# Altium project mopedka ver.PrjPcb
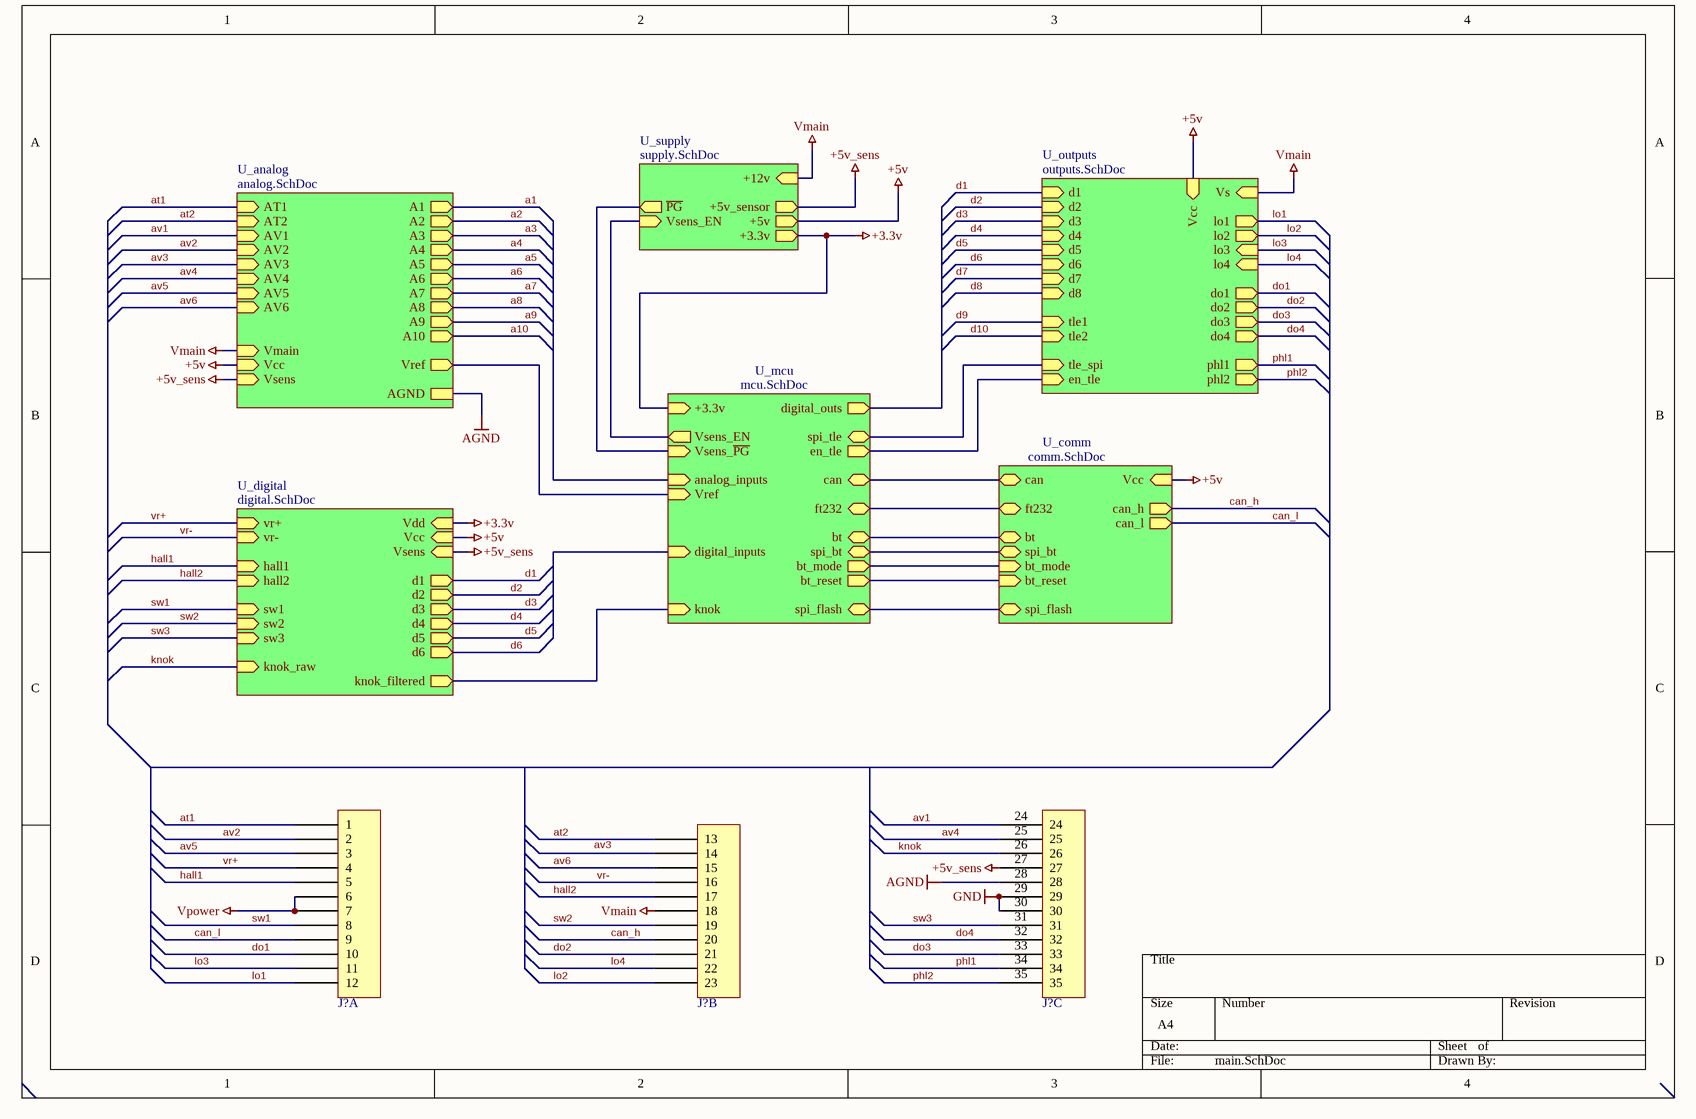
[diagram p0: main.SchDoc]
7 sheets, 327 parts. Net scope: hierarchical (ports join the sheet entries above them; power ports are global).
Board file: PCB1.PcbDoc
Sheets:
  main.SchDoc
    U_analog = analog.SchDoc
    U_digital = digital.SchDoc
    U_outputs = outputs.SchDoc
    U_comm = comm.SchDoc
    U_supply = supply.SchDoc
    U_mcu = mcu.SchDoc

## Sheet main.SchDoc
size A4

### Parts
(Parts that share a designator on the sheet are numbered #1, #2 ... from top to bottom, then left to right.)
J?#1  Conn_TE_1-776163-1_eec  [TE_1-776163-1_0]  (value not drawn)  (part A of 3)
J?#2  Conn_TE_1-776163-1_eec  [TE_1-776163-1_0]  (value not drawn)  (part B of 3)
J?#3  Conn_TE_1-776163-1_eec  [TE_1-776163-1_0]  (value not drawn)  (part C of 3)

### Sub-sheets
U_analog = analog.SchDoc: AT1 (in), AT2 (in), AV1 (in), AV2 (in), AV3 (in), AV4 (in), AV5 (in), AV6 (in), A1 (out), A2 (out), A3 (out), A4 (out), A5 (out), A6 (out), A7 (out), A8 (out), A9 (out), A10 (out), Vmain (in), Vcc (in), Vsens (in), AGND, Vref (out)
U_comm = comm.SchDoc: can (bidir), bt (bidir), ft232 (bidir), spi_flash (bidir), spi_bt (bidir), can_h (out), can_l (out), Vcc (in), bt_mode (in), bt_reset (in)
U_digital = digital.SchDoc: hall1 (in), hall2 (in), sw1 (in), sw2 (in), knok_raw (in), vr+ (in), vr- (in), d1 (out), d2 (out), d3 (out), d4 (out), knok_filtered (out), d6 (out), sw3 (in), d5 (out), Vdd (in), Vcc (in), Vsens (in)
U_mcu = mcu.SchDoc: analog_inputs (in), digital_outs (out), +3.3v (in), Vsens_EN (out), Vsens_~{PG} (in), digital_inputs (in), knok (in), can (bidir), bt (bidir), ft232 (bidir), spi_tle (bidir), spi_flash (bidir), spi_bt (bidir), en_tle (out), bt_mode (out), bt_reset (out), Vref (in)
U_outputs = outputs.SchDoc: lo1 (out), lo2 (out), do1 (out), do2 (out), do3 (out), do4 (out), phl1 (out), phl2 (out), tle1 (in), tle2 (in), tle_spi (in), Vs (in), d1 (in), d2 (in), d3 (in), d4 (in), d5 (in), d6 (in), d7 (in), d8 (in), lo3 (in), lo4 (in), en_tle (in), Vcc (in)
U_supply = supply.SchDoc: +12v (in), +5v (out), +5v_sensor (out), +3.3v (out), ~{PG} (out), Vsens_EN (in)

### Nets
+3.3v: sheet U_analog/Vcc, sheet U_digital/Vdd, sheet U_digital/Vcc, sheet U_outputs/Vcc, sheet U_comm/Vcc, sheet U_supply/+5v, sheet U_supply/+3.3v, sheet U_mcu/+3.3v  [also labelled +5v]
+5v_sens: J?#3.27 ; sheet U_analog/Vsens, sheet U_digital/Vsens, sheet U_supply/+5v_sensor
AGND: J?#3.28 ; sheet U_analog/AGND
GND: J?#3.29 J?#3.30
Vmain: J?#2.18 ; sheet U_analog/Vmain, sheet U_outputs/Vs, sheet U_supply/+12v
Vpower: J?#1.6 J?#1.7
at1: J?#1.1 ; sheet U_analog/AT1
at2: J?#2.13 ; sheet U_analog/AT2
av1: J?#3.24 ; sheet U_analog/AV1
av2: J?#1.2 ; sheet U_analog/AV2
av4: J?#3.25 ; sheet U_analog/AV4
av5: J?#1.3 ; sheet U_analog/AV5
av6: J?#2.15 ; sheet U_analog/AV6
can_h: J?#2.20 ; sheet U_comm/can_h
can_l: J?#1.9 ; sheet U_comm/can_l
d1: sheet U_digital/d1, sheet U_outputs/d1
d2: sheet U_digital/d2, sheet U_outputs/d2
d3: sheet U_digital/d3, sheet U_outputs/d3
d4: sheet U_digital/d4, sheet U_outputs/d4
d5: sheet U_digital/d5, sheet U_outputs/d5
d6: sheet U_digital/d6, sheet U_outputs/d6
do1: J?#1.10 ; sheet U_outputs/do1
do2: J?#2.21 ; sheet U_outputs/do2
do3: J?#3.33 ; sheet U_outputs/do3
do4: J?#3.32 ; sheet U_outputs/do4
hall1: J?#1.5 ; sheet U_digital/hall1
hall2: J?#2.17 ; sheet U_digital/hall2
knok: J?#3.26 ; sheet U_digital/knok_raw
lo1: J?#1.12 ; sheet U_outputs/lo1
lo2: J?#2.23 ; sheet U_outputs/lo2
lo3: J?#1.11 ; sheet U_outputs/lo3
lo4: J?#2.22 ; sheet U_outputs/lo4
phl1: J?#3.34 ; sheet U_outputs/phl1
phl2: J?#3.35 ; sheet U_outputs/phl2
sw1: J?#1.8 ; sheet U_digital/sw1
sw2: J?#2.19 ; sheet U_digital/sw2
sw3: J?#3.31 ; sheet U_digital/sw3
vr+: J?#1.4 ; sheet U_digital/vr+
vr-: J?#2.16 ; sheet U_digital/vr-
NetIC?#12_4: sheet U_digital/knok_filtered, sheet U_mcu/knok
NetR?#1_2: sheet U_analog/Vref, sheet U_mcu/Vref
NetR?#96_2: sheet U_outputs/en_tle, sheet U_mcu/en_tle
NetR?#98_1: sheet U_comm/bt_mode, sheet U_mcu/bt_mode
NetR?#100_1: sheet U_comm/bt_reset, sheet U_mcu/bt_reset
NetR?#126_2: sheet U_supply/~{PG}, sheet U_mcu/Vsens_~{PG}
NetR?#128_1: sheet U_supply/Vsens_EN, sheet U_mcu/Vsens_EN

Not connected (* = marked no-connect by the designer): J?#2 14

### Buses and harness runs
bus sheet U_comm/bt = sheet U_mcu/bt
bus sheet U_comm/can = sheet U_mcu/can
bus sheet U_comm/ft232 = sheet U_mcu/ft232
bus sheet U_comm/spi_bt = sheet U_mcu/spi_bt
bus sheet U_comm/spi_flash = sheet U_mcu/spi_flash
bus sheet U_mcu/spi_tle = sheet U_outputs/tle_spi

### Notes on the sheet
- Labels drawn without touching a wire or pin: av3

### Library data of the parts
J?#1-J?#3 = Conn_TE_1-776163-1_eec: CONN 35 Positions Header, Shrouded Connector 0.157" (4.00mm) Panel Mount, Through Hole, Right Angle Gold-Palladium; Manufacturer: TE; helpURL: https://upverter.com/upn/revision/16af53c132ac2fb1/; ComponentLink2Description: Datasheet; Temperature: to; Package: CONN_PTH_76MM9_18MM6; Supplier 2: Mouser; Price: 11.0652877997; Supplier 1: Digi-Key; ComponentLink1URL: https://upverter.com/upn/revision/16af53c132ac2fb1/; Supplier Part Number 2: 571-1-776163-1; Supplier Part Number 1: A106383-ND; ComponentLink1Description: Upverter; ComponentLink2URL: http://www.mouser.com/ds/2/418/NG_CD_776163_J8-683122.pdf; RoHS: TRUE; Mouser Part Number: 571-1-776163-1; Digikey Description: CONN 35 Positions Header, Shrouded Connector 0.157" (4.00mm) Panel Mount, Through Hole, Right Angle Gold-Palladium; Digikey Part Number: A106383-ND; Lead Free: yes

## Sheet analog.SchDoc
size A4
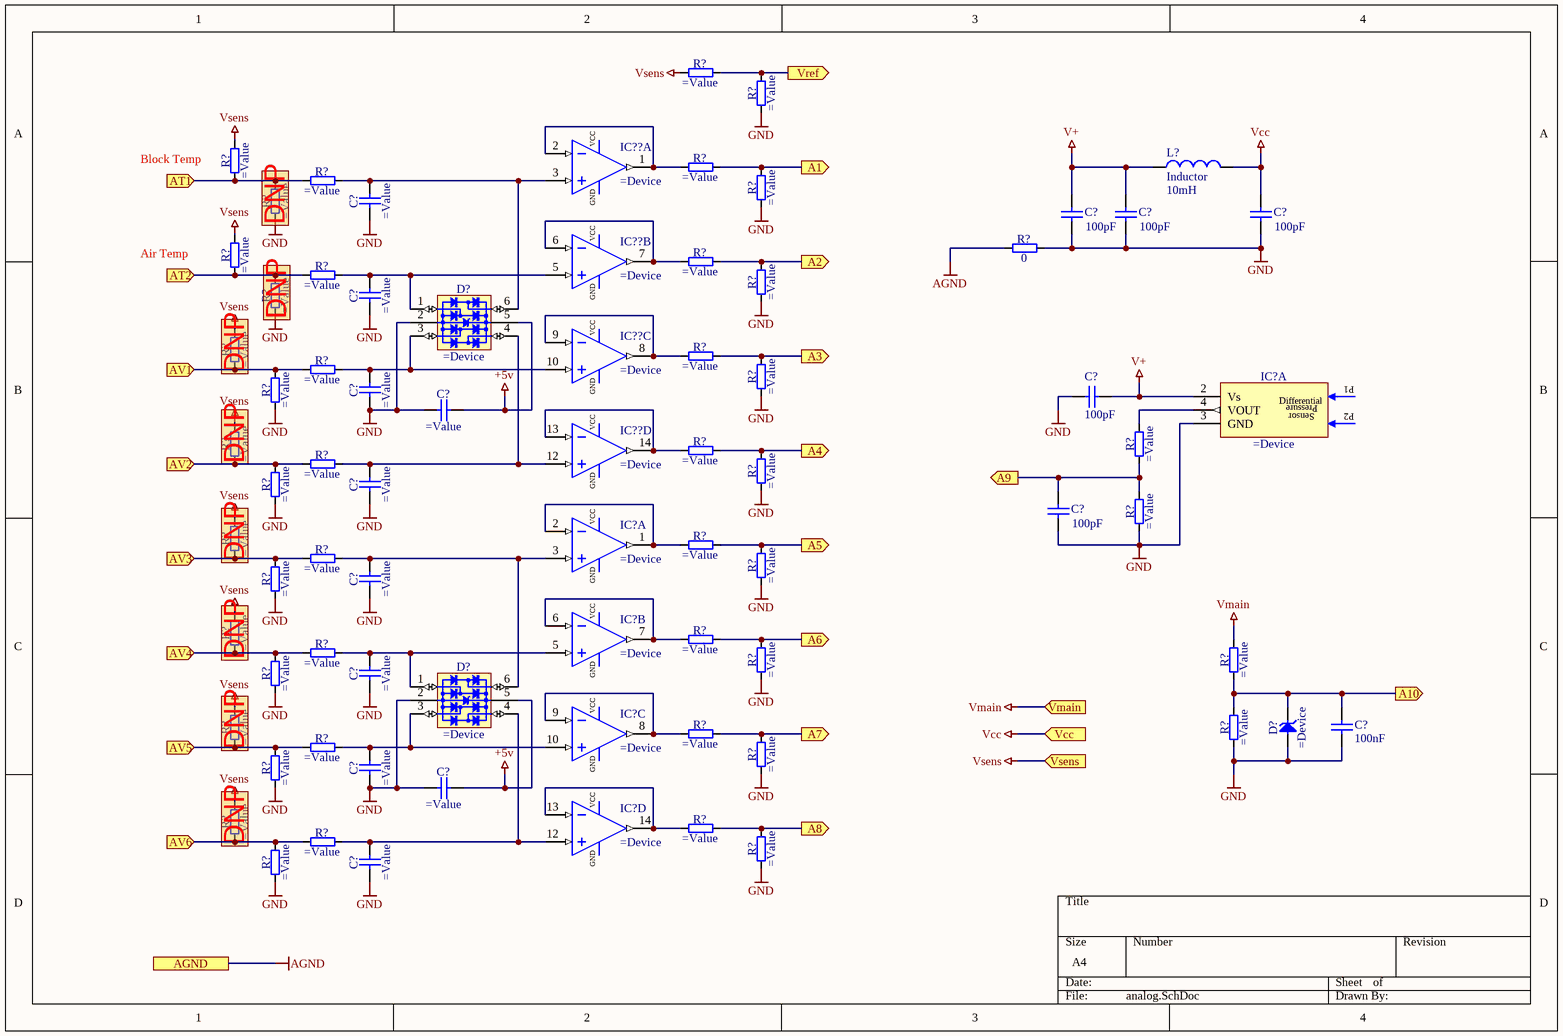
[diagram p1: analog.SchDoc]

### Parts
(Parts that share a designator on the sheet are numbered #1, #2 ... from top to bottom, then left to right.)
C?#1  (no value)
C?#2  value 100pF  [RAD-0.3]  (hidden comment: Cap)
C?#3  value 100pF  [RAD-0.3]  (hidden comment: Cap)
C?#4  value 100pF  [RAD-0.3]  (hidden comment: Cap)
C?#5  (no value)
C?#6  value 100pF  [RAD-0.3]  (hidden comment: Cap)
C?#7  (no value)
C?#8  (no value)
C?#9  (no value)
C?#10  value 100pF  [RAD-0.3]  (hidden comment: Cap)
C?#11  (no value)
C?#12  (no value)
C?#13  value 100nF  [RAD-0.3]  (hidden comment: Cap)
C?#14  (no value)
C?#15  (no value)
C?#16  (no value)
D?#1  (no value)
D?#2  (no value)
D?#3  (no value)
IC?#1  (no value)  (part A of 2)
IC?#2  (no value)  (part A of 4)
IC?#3  (no value)  (part B of 4)
IC?#4  (no value)  (part C of 4)
IC?#5  (no value)  (part D of 4)
IC??#1  (no value)  (part A of 4)
IC??#2  (no value)  (part B of 4)
IC??#3  (no value)  (part C of 4)
IC??#4  (no value)  (part D of 4)
L?#1  Inductor  value 10mH  [0402-A]
R?#1  (no value)
R?#2  (no value)
R?#3  (no value)
R?#4  (no value)
R?#5  (no value)
R?#6  (no value)
R?#7  (no value)
R?#8  0
R?#9  (no value)
R?#10  (no value)
R?#11  (no value)
R?#12  (no value)
R?#13  (no value)
R?#14  (no value)
R?#15  (no value)
R?#16  (no value)
R?#17  (no value)
R?#18  (no value)
R?#19  (no value)
R?#20  (no value)
R?#21  (no value)
R?#22  (no value)
R?#23  (no value)
R?#24  (no value)
R?#25  (no value)
R?#26  (no value)
R?#27  (no value)
R?#28  (no value)
R?#29  (no value)
R?#30  (no value)
R?#31  (no value)
R?#32  (no value)
R?#33  (no value)
R?#34  (no value)
R?#35  (no value)
R?#36  (no value)
R?#37  (no value)
R?#38  (no value)
R?#39  (no value)
R?#40  (no value)
R?#41  (no value)
R?#42  (no value)
R?#43  (no value)
R?#44  (no value)
R?#45  (no value)
R?#46  (no value)
R?#47  (no value)

### Ports
A1 (out), A2 (out), A3 (out), A4 (out), A5 (out), A6 (out), A7 (out), A8 (out), A9 (out), A10 (out), AGND, AT1 (in), AT2 (in), AV1 (in), AV2 (in), AV3 (in), AV4 (in), AV5 (in), AV6 (in), Vcc (in), Vmain (in), Vref (out), Vsens (in)

### Nets
+5v: C?#4.2 C?#8.2 C?#15.2 D?#1.5(VBUS) D?#2.5(VBUS) L?#1.2 ; port Vcc  [also labelled Vcc]  [project net +3.3v]
AGND: R?#8.1 ; port AGND
GND: C?#1.1 C?#2.1 C?#3.1 C?#4.1 C?#5.1 C?#6.1 C?#7.1 C?#8.1 C?#9.1 C?#10.1 C?#11.1 C?#12.1 C?#13.1 C?#14.1 C?#15.1 C?#16.1 D?#1.2(GND) D?#2.2(GND) D?#3.2(A) IC?#1.3(GND) R?#2.1 R?#6.1 R?#7.1 R?#8.2 R?#12.1 R?#13.1 R?#17.1 R?#18.1 R?#23.1 R?#24.1 R?#25.1 R?#29.1 R?#30.1 R?#34.1 R?#36.1 R?#40.1 R?#41.1 R?#42.1 R?#46.1 R?#47.1
V+: C?#2.2 C?#3.2 C?#6.2 IC?#1.2(Vs) L?#1.1
Vmain: R?#35.2 ; port Vmain
Vsens: R?#1.1 R?#4.2 R?#10.2 R?#15.2 R?#20.2 R?#27.2 R?#32.2 R?#38.2 R?#44.2 ; port Vsens  [project net +5v_sens]
a1: R?#3.2 R?#6.2 ; port A1
a2: R?#9.2 R?#12.2 ; port A2
a3: R?#14.2 R?#17.2 ; port A3
a4: R?#19.2 R?#23.2 ; port A4
a5: R?#26.2 R?#29.2 ; port A5
a6: R?#31.2 R?#34.2 ; port A6
a7: R?#37.2 R?#41.2 ; port A7
a8: R?#43.2 R?#46.2 ; port A8
a9: C?#10.2 R?#22.1 R?#25.2 ; port A9
a10: C?#13.2 D?#3.1(C) R?#35.1 R?#40.2 ; port A10
at1: R?#4.1 R?#5.1 R?#7.2 ; port AT1
at2: R?#10.1 R?#11.1 R?#13.2 ; port AT2
av1: R?#15.1 R?#16.1 R?#18.2 ; port AV1
av2: R?#20.1 R?#21.1 R?#24.2 ; port AV2
av3: R?#27.1 R?#28.1 R?#30.2 ; port AV3
av4: R?#32.1 R?#33.1 R?#36.2 ; port AV4
av5: R?#38.1 R?#39.1 R?#42.2 ; port AV5
av6: R?#44.1 R?#45.1 R?#47.2 ; port AV6
NetC?#1_2: C?#1.2 D?#1.6(I/O4) IC??#1.3(IN+) R?#5.2
NetC?#5_2: C?#5.2 D?#1.1(I/O1) IC??#2.5(IN+) R?#11.2
NetC?#7_2: C?#7.2 D?#1.3(I/O2) IC??#3.10(IN+) R?#16.2
NetC?#9_2: C?#9.2 D?#1.4(I/O3) IC??#4.12(IN+) R?#21.2
NetC?#11_2: C?#11.2 D?#2.6(I/O4) IC?#2.3(IN+) R?#28.2
NetC?#12_2: C?#12.2 D?#2.1(I/O1) IC?#3.5(IN+) R?#33.2
NetC?#14_2: C?#14.2 D?#2.3(I/O2) IC?#4.10(IN+) R?#39.2
NetC?#16_2: C?#16.2 D?#2.4(I/O3) IC?#5.12(IN+) R?#45.2
NetIC?#1_4: IC?#1.4(VOUT) R?#22.2
NetIC?#2_1: IC?#2.1(OUT) IC?#2.2(IN-) R?#26.1
NetIC?#3_6: IC?#3.6(IN-) IC?#3.7(OUT) R?#31.1
NetIC?#4_8: IC?#4.8(OUT) IC?#4.9(IN-) R?#37.1
NetIC?#5_13: IC?#5.13(IN-) IC?#5.14(OUT) R?#43.1
NetIC??#1_1: IC??#1.1(OUT) IC??#1.2(IN-) R?#3.1
NetIC??#2_6: IC??#2.6(IN-) IC??#2.7(OUT) R?#9.1
NetIC??#3_8: IC??#3.8(OUT) IC??#3.9(IN-) R?#14.1
NetIC??#4_13: IC??#4.13(IN-) IC??#4.14(OUT) R?#19.1
NetR?#1_2: R?#1.2 R?#2.2 ; port Vref

Not connected (* = marked no-connect by the designer): IC?#2 4(V+) 11(GND); IC?#3 4(V+) 11(GND); IC?#4 4(V+) 11(GND); IC?#5 4(V+) 11(GND); IC??#1 4(V+) 11(GND); IC??#2 4(V+) 11(GND); IC??#3 4(V+) 11(GND); IC??#4 4(V+) 11(GND)

### Notes on the sheet
- (near R?#4) Block Temp
- (near R?#7) DNP
- (near R?#10) Air Temp
- (near R?#13) DNP
- (near R?#15) DNP
- (near R?#20) DNP
- (near R?#27) DNP
- (near R?#32) DNP
- (near R?#38) DNP
- (near R?#44) DNP
- (in symbol MP3V5004DP, part A) P1; Differential; Pressure; Sensor; P2
- (in symbol Operational Amplifier x4 Type4, part A) VCC
- (in symbol Operational Amplifier x4 Type4, part B) VCC
- (in symbol Operational Amplifier x4 Type4, part C) VCC
- (in symbol Operational Amplifier x4 Type4, part D) VCC

### Library data of the parts
C?#1 C?#5 C?#7-C?#9 C?#11 C?#12 C?#14-C?#16 = Capacitor - non polarized: Non-polarised capacitor
C?#2-C?#4 C?#6 C?#10 C?#13 = Cap: Capacitor; Published: 8-Jun-2000; LatestRevisionDate: 17-Jul-2002; LatestRevisionNote: Re-released for DXP Platform.; PackageReference: RAD-0.3; Publisher: Altium Limited; PackageDescription: Radial Cap, Thru-Hole; 2 Leads; 0.3 in Pin Spacing
D?#1 D?#2 = SRV05-4: RailClamps Low Capacitance TVS Diode Array
D?#3 = Diode Zener: Zener Diode
IC?#1 = MP3V5004DP: Integrated Silicon Pressure Sensor, On-Chip Signal Conditioned, Temperature Compensated and Calibrated
IC?#2-IC?#5 IC??#1-IC??#4 = Operational Amplifier x4 Type4: Quad Operational Amplifier
L?#1 = Inductor: Code_IEC: 1005; Published: 8-Jun-2000; LatestRevisionDate: 29-May-2009; LatestRevisionNote: IPC-7351 Footprint Added.; PackageReference: 0402-A; Publisher: Altium Limited; PackageDescription: Chip Inductor; Code_JEITA: 0402
R?#1-R?#47 = Resistor
  R?#8: Value: 0

## Sheet digital.SchDoc
size A4
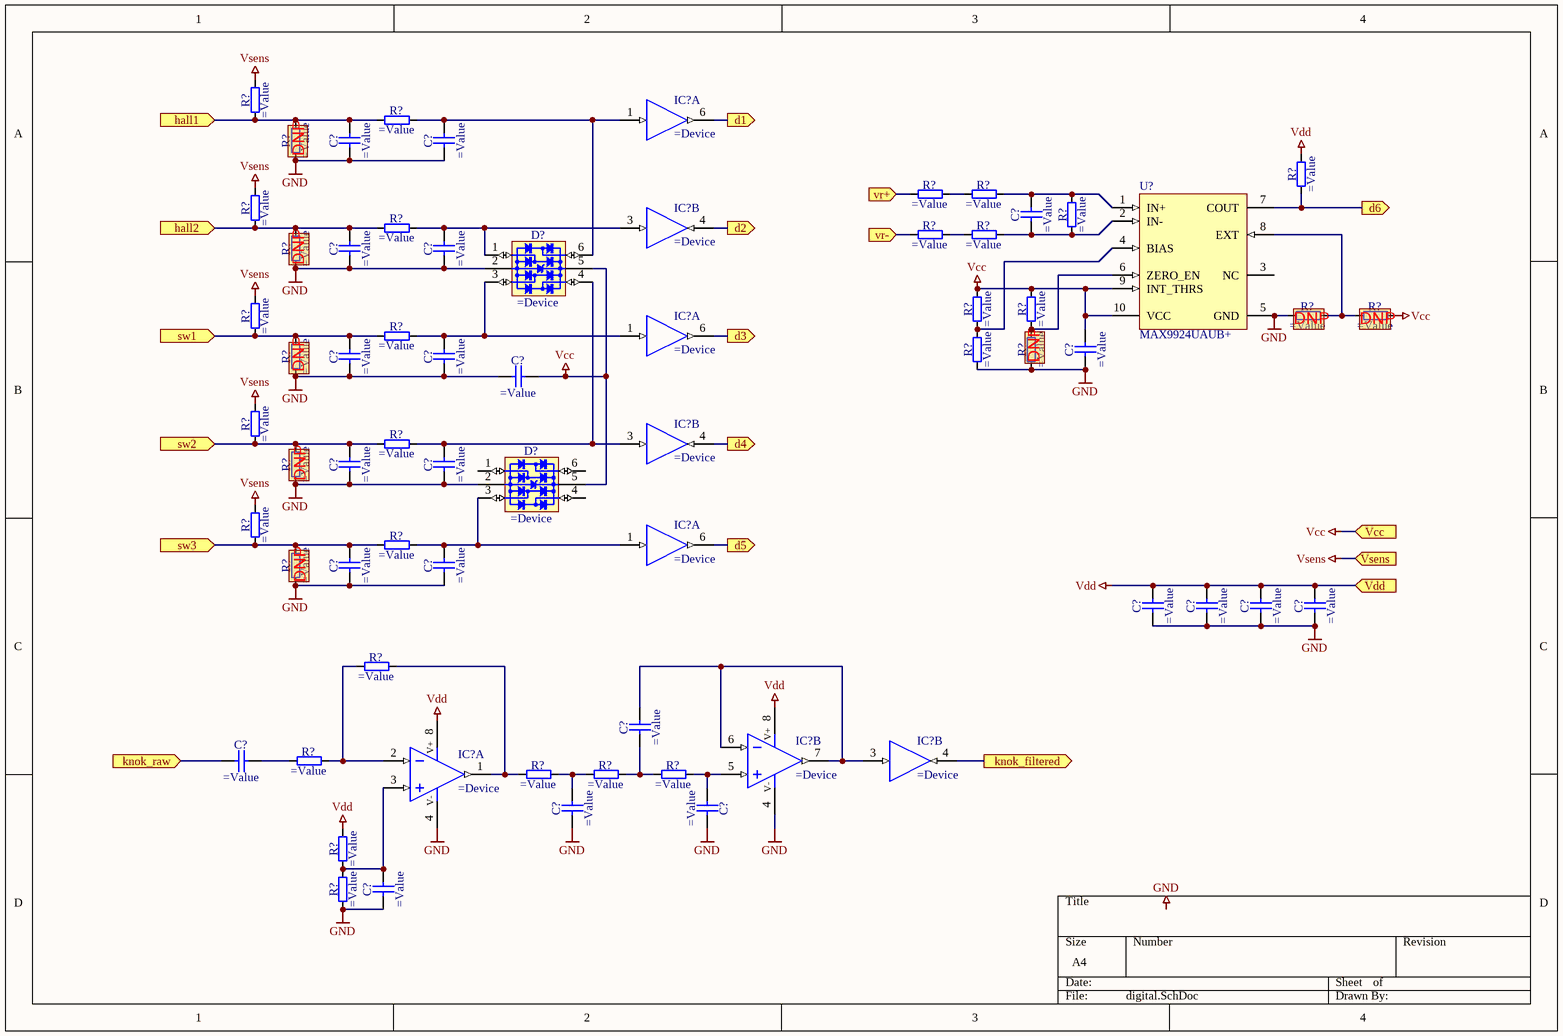
[diagram p2: digital.SchDoc]

### Parts
(Parts that share a designator on the sheet are numbered #1, #2 ... from top to bottom, then left to right.)
C?#17  (no value)
C?#18  (no value)
C?#19  (no value)
C?#20  (no value)
C?#21  (no value)
C?#22  (no value)
C?#23  (no value)
C?#24  (no value)
C?#25  (no value)
C?#26  (no value)
C?#27  (no value)
C?#28  (no value)
C?#29  (no value)
C?#30  (no value)
C?#31  (no value)
C?#32  (no value)
C?#33  (no value)
C?#34  (no value)
C?#35  (no value)
C?#36  (no value)
C?#37  (no value)
C?#38  (no value)
D?#4  (no value)
D?#5  (no value)
IC?#6  (no value)  (part A of 2)
IC?#7  (no value)  (part B of 2)
IC?#8  (no value)  (part A of 2)
IC?#9  (no value)  (part B of 2)
IC?#10  (no value)  (part A of 2)
IC?#11  (no value)  (part B of 2)
IC?#12  (no value)  (part B of 2)
IC?#13  (no value)  (part A of 2)
R?#48  (no value)
R?#49  (no value)
R?#50  (no value)
R?#51  (no value)
R?#52  (no value)
R?#53  (no value)
R?#54  (no value)
R?#55  (no value)
R?#56  (no value)
R?#57  (no value)
R?#58  (no value)
R?#59  (no value)
R?#60  (no value)
R?#61  (no value)
R?#62  (no value)
R?#63  (no value)
R?#64  (no value)
R?#65  (no value)
R?#66  (no value)
R?#67  (no value)
R?#68  (no value)
R?#69  (no value)
R?#70  (no value)
R?#71  (no value)
R?#72  (no value)
R?#73  (no value)
R?#74  (no value)
R?#75  (no value)
R?#76  (no value)
R?#77  (no value)
R?#78  (no value)
R?#79  (no value)
R?#80  (no value)
R?#81  (no value)
U?#1  MAX9924UAUB+  [MAXM-U10+2_L]

### Ports
d1 (out), d2 (out), d3 (out), d4 (out), d5 (out), d6 (out), hall1 (in), hall2 (in), knok_filtered (out), knok_raw (in), sw1 (in), sw2 (in), sw3 (in), Vcc (in), Vdd (in), vr+ (in), vr- (in), Vsens (in)

### Nets
GND: C?#17.1 C?#18.1 C?#20.1 C?#21.1 C?#22.1 C?#23.1 C?#24.1 C?#25.1 C?#26.1 C?#27.1 C?#28.1 C?#29.1 C?#30.1 C?#31.1 C?#32.1 C?#33.1 C?#36.2 C?#37.1 C?#38.1 D?#4.2(GND) D?#5.2(GND) IC?#6.2(GND) IC?#7.2(GND) IC?#8.2(GND) IC?#9.2(GND) IC?#10.2(GND) IC?#11.4(V-) IC?#12.2(GND) IC?#13.4(V-) R?#50.1 R?#59.1 R?#60.1 R?#66.1 R?#67.1 R?#68.1 R?#71.1 R?#74.1 R?#81.1 U?#1.5(GND)
Vcc: C?#22.2 C?#25.2 C?#30.2 C?#31.2 C?#32.2 C?#33.2 D?#4.5(VBUS) D?#5.5(VBUS) IC?#6.5(Vdd) IC?#7.5(Vdd) IC?#8.5(Vdd) IC?#9.5(Vdd) IC?#10.5(Vdd) IC?#11.8(V+) IC?#12.5(Vdd) IC?#13.8(V+) R?#53.2 R?#61.2 R?#62.2 R?#63.2 R?#80.2 U?#1.9(INT_THRS) U?#1.10(VCC) ; port Vdd, port Vcc  [also labelled Vdd]  [project net +3.3v]
Vsens: R?#48.2 R?#54.2 R?#64.2 R?#69.2 R?#72.2 ; port Vsens  [project net +5v_sens]
d1: IC?#6.6(OUT) ; port d1
d2: IC?#7.4(OUT) ; port d2
d3: IC?#8.6(OUT) ; port d3
d4: IC?#9.4(OUT) ; port d4
d5: IC?#10.6(OUT) ; port d5
d6: R?#53.1 U?#1.7(COUT) ; port d6
hall1: C?#17.2 R?#48.1 R?#49.1 R?#50.2 ; port hall1
hall2: C?#20.2 R?#54.1 R?#55.1 R?#59.2 ; port hall2
knok: C?#35.1 ; port knok_raw
sw1: C?#23.2 R?#64.1 R?#65.1 R?#68.2 ; port sw1
sw2: C?#26.2 R?#69.1 R?#70.1 R?#71.2 ; port sw2
sw3: C?#28.2 R?#72.1 R?#73.1 R?#74.2 ; port sw3
vr+: R?#51.1 ; port vr+
vr-: R?#56.1 ; port vr-
NetC?#18_2: C?#18.2 D?#4.6(I/O4) IC?#6.1(IN) R?#49.2
NetC?#19_1: C?#19.1 R?#57.2 R?#58.1 U?#1.2(IN-)
NetC?#19_2: C?#19.2 R?#52.2 R?#58.2 U?#1.1(IN+)
NetC?#21_2: C?#21.2 D?#4.1(I/O1) IC?#7.3(IN) R?#55.2
NetC?#24_2: C?#24.2 D?#4.3(I/O2) IC?#8.1(IN) R?#65.2
NetC?#27_2: C?#27.2 D?#4.4(I/O3) IC?#9.3(IN) R?#70.2
NetC?#29_2: C?#29.2 D?#5.3(I/O2) IC?#10.1(IN) R?#73.2
NetC?#34_1: C?#34.1 R?#78.2 R?#79.1
NetC?#34_2: C?#34.2 IC?#11.6(IN-) IC?#11.7(OUT) IC?#12.3(IN)
NetC?#35_2: C?#35.2 R?#76.1
NetC?#36_1: C?#36.1 IC?#11.5(IN+) R?#79.2
NetC?#37_2: C?#37.2 R?#77.2 R?#78.1
NetC?#38_2: C?#38.2 IC?#13.3(IN+) R?#80.1 R?#81.2
NetIC?#12_4: IC?#12.4(OUT) ; port knok_filtered
NetIC?#13_1: IC?#13.1(OUT) R?#75.2 R?#77.1
NetIC?#13_2: IC?#13.2(IN-) R?#75.1 R?#76.2
NetR?#51_2: R?#51.2 R?#52.1
NetR?#56_2: R?#56.2 R?#57.1
NetR?#60_2: R?#60.2 R?#61.1 U?#1.8(EXT)
NetR?#62_1: R?#62.1 R?#66.2 U?#1.4(BIAS)
NetR?#63_1: R?#63.1 R?#67.2 U?#1.6(ZERO_EN)

Not connected (* = marked no-connect by the designer): D?#5 1(I/O1) 4(I/O3) 6(I/O4); U?#1 3(NC)

### Notes on the sheet
- (near R?#50) DNP
- (near R?#59) DNP
- (near R?#68) DNP
- (near R?#67) DNP
- (near R?#60) DNP
- (near R?#61) DNP
- (near R?#71) DNP
- (near R?#74) DNP
- Labels drawn without touching a wire or pin: GND

### Library data of the parts
C?#17-C?#38 = Capacitor - non polarized: Non-polarised capacitor
D?#4 D?#5 = SRV05-4: as D?#1 on sheet analog
IC?#6-IC?#10 IC?#12 = 742G17: Dual Schmitt-Trigger Buffer
IC?#11 IC?#13 = Operational Amplifier x2 Type1: Dual Operational Amplifier
R?#48-R?#81 = Resistor
U?#1 = MAX9924UAUB+: Single-Channel, Variable Reluctance Sensor Interface with No Low Power Shutdown, 4.5 to 5.5 V, -40 to 125 degC, 10-Pin SOP (U10+2), Pb-Free; Industry Qualified: Automotive - AECQ100, Automotive - General; Channels: 1; ComponentLink1Description: Manufacturer URL; ComponentLink2Description: Datasheet; DatasheetVersion: Rev. 4; Generic Part Number: MAX9924; Low Pwr. Shutdn: No; ComponentLink3URL: http://pdfserv.maximintegrated.com/package_dwgs/21-0061.PDF; ComponentLink3Description: Package Specification; ComponentLink1URL: http://www.maximintegrated.com/; ComponentLink2URL: http://datasheets.maximintegrated.com/en/ds/MAX9924-MAX9927.pdf; Code_JEDEC: MO-187; PackageVersion: Rev. L, 07/2008; PartNumber: MAX9924UAUB+; PackageDescription: 10-Pin Micro-MAX, Thin Shrink Small-Outline (U10+2), Body 3 x 3 mm, Pitch 0.5 mm; Mounting Technology: Surface Mount; PackageReference: U10+2

## Sheet outputs.SchDoc
size A4
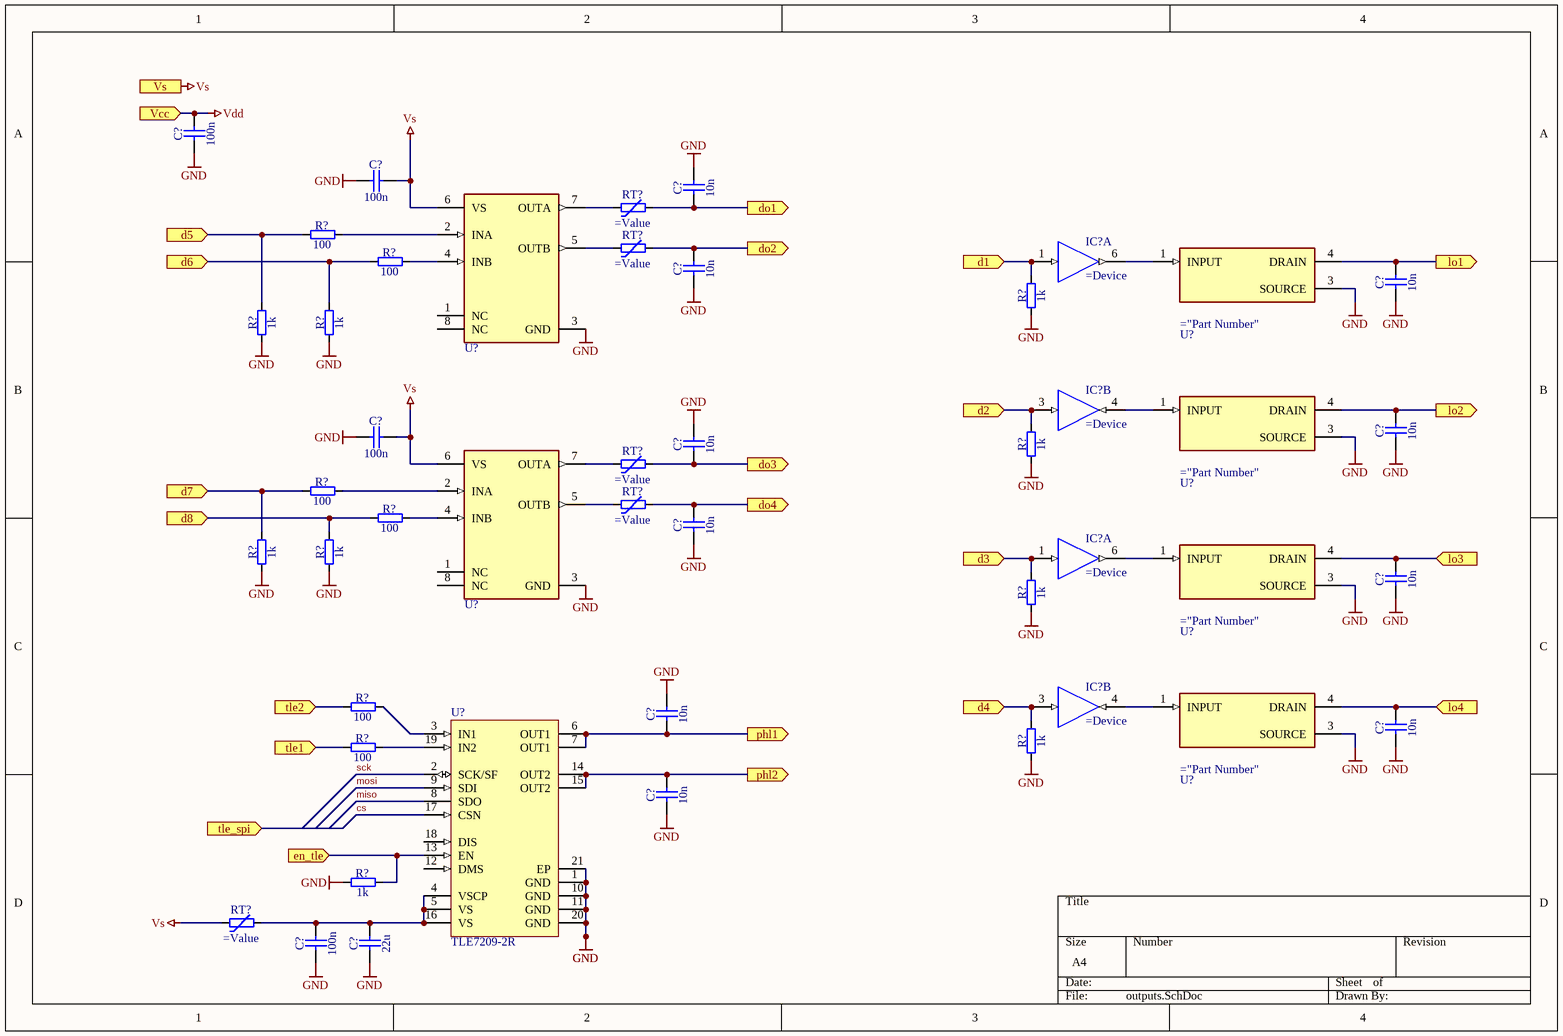
[diagram p3: outputs.SchDoc]

### Parts
(Parts that share a designator on the sheet are numbered #1, #2 ... from top to bottom, then left to right.)
C?#39  100n
C?#40  100n
C?#41  10n
C?#42  10n
C?#43  10n
C?#44  100n
C?#45  10n
C?#46  10n
C?#47  10n
C?#48  10n
C?#49  10n
C?#50  10n
C?#51  10n
C?#52  100n
C?#53  22u
IC?#14  (no value)  (part A of 2)
IC?#15  (no value)  (part B of 2)
IC?#16  (no value)  (part A of 2)
IC?#17  (no value)  (part B of 2)
R?#82  100
R?#83  100
R?#84  1k
R?#85  1k
R?#86  1k
R?#87  1k
R?#88  100
R?#89  100
R?#90  1k
R?#91  1k
R?#92  1k
R?#93  100
R?#94  100
R?#95  1k
R?#96  1k
RT?#1  (no value)
RT?#2  (no value)
RT?#3  (no value)
RT?#4  (no value)
RT?#5  (no value)
U?#2  IR4427STRPBF  (value not drawn)
U?#3  VND7NV04TR-E  (value not drawn)
U?#4  VND7NV04TR-E  (value not drawn)
U?#5  IR4427STRPBF  (value not drawn)
U?#6  VND7NV04TR-E  (value not drawn)
U?#7  VND7NV04TR-E  (value not drawn)
U?#8  TLE7209-2R  [INF-PG-DSO-20-37_M]

### Ports
d1 (in), d2 (in), d3 (in), d4 (in), d5 (in), d6 (in), d7 (in), d8 (in), do1 (out), do2 (out), do3 (out), do4 (out), en_tle (in), lo1 (out), lo2 (out), lo3 (in), lo4 (in), phl1 (out), phl2 (out), tle1 (in), tle2 (in), tle_spi (in), Vcc (in), Vs (in)

### Nets
GND: C?#39.1 C?#40.1 C?#41.2 C?#42.1 C?#43.1 C?#44.1 C?#45.1 C?#46.2 C?#47.1 C?#48.1 C?#49.2 C?#50.1 C?#51.1 C?#52.1 C?#53.1 IC?#14.2(GND) IC?#15.2(GND) IC?#16.2(GND) IC?#17.2(GND) R?#84.1 R?#85.1 R?#86.1 R?#87.1 R?#90.1 R?#91.1 R?#92.1 R?#95.1 R?#96.1 U?#2.3(GND) U?#3.3(SOURCE) U?#4.3(SOURCE) U?#5.3(GND) U?#6.3(SOURCE) U?#7.3(SOURCE) U?#8.1(GND) U?#8.10(GND) U?#8.11(GND) U?#8.20(GND) U?#8.21(EP)
Vdd: C?#39.2 IC?#14.5(Vdd) IC?#15.5(Vdd) IC?#16.5(Vdd) IC?#17.5(Vdd) ; port Vcc  [project net +3.3v]
Vs: C?#40.2 C?#44.2 RT?#5.1 U?#2.6(VS) U?#5.6(VS) ; port Vs  [project net Vmain]
cs: U?#8.17(CSN)
d1: IC?#14.1(IN) R?#84.2 ; port d1
d2: IC?#15.3(IN) R?#87.2 ; port d2
d3: IC?#16.1(IN) R?#92.2 ; port d3
d4: IC?#17.3(IN) R?#95.2 ; port d4
d5: R?#82.1 R?#85.2 ; port d5
d6: R?#83.1 R?#86.2 ; port d6
d7: R?#88.1 R?#90.2 ; port d7
d8: R?#89.1 R?#91.2 ; port d8
d9: R?#94.1 ; port tle1
d10: R?#93.1 ; port tle2
do1: C?#41.1 RT?#1.2 ; port do1
do2: C?#42.2 RT?#2.2 ; port do2
do3: C?#46.1 RT?#3.2 ; port do3
do4: C?#47.2 RT?#4.2 ; port do4
lo1: C?#43.2 U?#3.4(DRAIN) ; port lo1
lo2: C?#45.2 U?#4.4(DRAIN) ; port lo2
lo3: C?#48.2 U?#6.4(DRAIN) ; port lo3
lo4: C?#50.2 U?#7.4(DRAIN) ; port lo4
miso: U?#8.8(SDO)
mosi: U?#8.9(SDI)
phl1: C?#49.1 U?#8.6(OUT1) U?#8.7(OUT1) ; port phl1
phl2: C?#51.2 U?#8.14(OUT2) U?#8.15(OUT2) ; port phl2
sck: U?#8.2(SCK/SF)
NetC?#52_2: C?#52.2 C?#53.2 RT?#5.2 U?#8.4(VSCP) U?#8.5(VS) U?#8.16(VS)
NetIC?#14_6: IC?#14.6(OUT) U?#3.1(INPUT)
NetIC?#15_4: IC?#15.4(OUT) U?#4.1(INPUT)
NetIC?#16_6: IC?#16.6(OUT) U?#6.1(INPUT)
NetIC?#17_4: IC?#17.4(OUT) U?#7.1(INPUT)
NetR?#82_2: R?#82.2 U?#2.2(INA)
NetR?#83_2: R?#83.2 U?#2.4(INB)
NetR?#88_2: R?#88.2 U?#5.2(INA)
NetR?#89_2: R?#89.2 U?#5.4(INB)
NetR?#93_2: R?#93.2 U?#8.3(IN1)
NetR?#94_2: R?#94.2 U?#8.19(IN2)
NetR?#96_2: R?#96.2 U?#8.13(EN) ; port en_tle
NetRT?#1_1: RT?#1.1 U?#2.7(OUTA)
NetRT?#2_1: RT?#2.1 U?#2.5(OUTB)
NetRT?#3_1: RT?#3.1 U?#5.7(OUTA)
NetRT?#4_1: RT?#4.1 U?#5.5(OUTB)

Not connected (* = marked no-connect by the designer): U?#2 1(NC) 8(NC); U?#5 1(NC) 8(NC); U?#8 12(DMS) 18(DIS)

### Library data of the parts
C?#39-C?#53 = Capacitor - non polarized: Non-polarised capacitor
  C?#39 C?#40 C?#44 C?#52: Value: 100n
  C?#41-C?#43 C?#45-C?#51: Value: 10n
  C?#53: Value: 22u
IC?#14-IC?#17 = 742G17: Dual Schmitt-Trigger Buffer
R?#82-R?#96 = Resistor
  R?#82 R?#83 R?#88 R?#89 R?#93 R?#94: Value: 100
  R?#84-R?#87 R?#90-R?#92 R?#95 R?#96: Value: 1k
RT?#1-RT?#5 = Thermistor PTC: Thermistor NTC (Positive Temperature Coefficient)
U?#8 = TLE7209-2R: 7 A H-Bridge for DC-Motor Applications, 5 to 28 V, 150 mOhm RDS(on), PG-DSO-20-37, Reel, Green; Manufacturer: Infineon; Operating Range: 5 to 28 V; RthJC (max): 1.5 K/W; Green: TRUE; Current Limit (min.): 5.5 A; Quiescent Current (max.): 20 mA; ComponentLink1Description: Manufacturer URL; ComponentLink2Description: Datasheet; RDS (on) (typ./switch): 150 mOhm; DatasheetVersion: Rev. 1.5; ComponentLink3URL: http://www.infineon.com/cms/packages/SMD_-_Surface_Mounted_Devices/P-PG-DSO/P-PG-DSO-20-10x_-12x_-13x_-16x_-33x_-34x_-37x_-48x_-50.html?__locale=en; ComponentLink3Description: Package Specification; ComponentLink1URL: http://www.infineon.com/; ComponentLink2URL: http://www.infineon.com/dgdl/TLE7209-2R-Data+Sheet-Infineon-v15.pdf?folderId=db3a30431b3e89eb011bb632994f065b&fileId=db3a30431f848401011fc76ca8e77a06&sId=db3a30443d67b5ca013d7f7d1d1f2bb3; PackageReference: PG-DSO-20-37; Packing: Reel; Mounting Technology: Surface Mount; Halogen-free: TRUE; PackageDescription: 20-Pin Plastic (Green) Dual Small Outline Package, 15.9 x 11 mm Body, 1.27 mm Pitch; PartNumber: TLE7209-2R

## Sheet comm.SchDoc
size A4
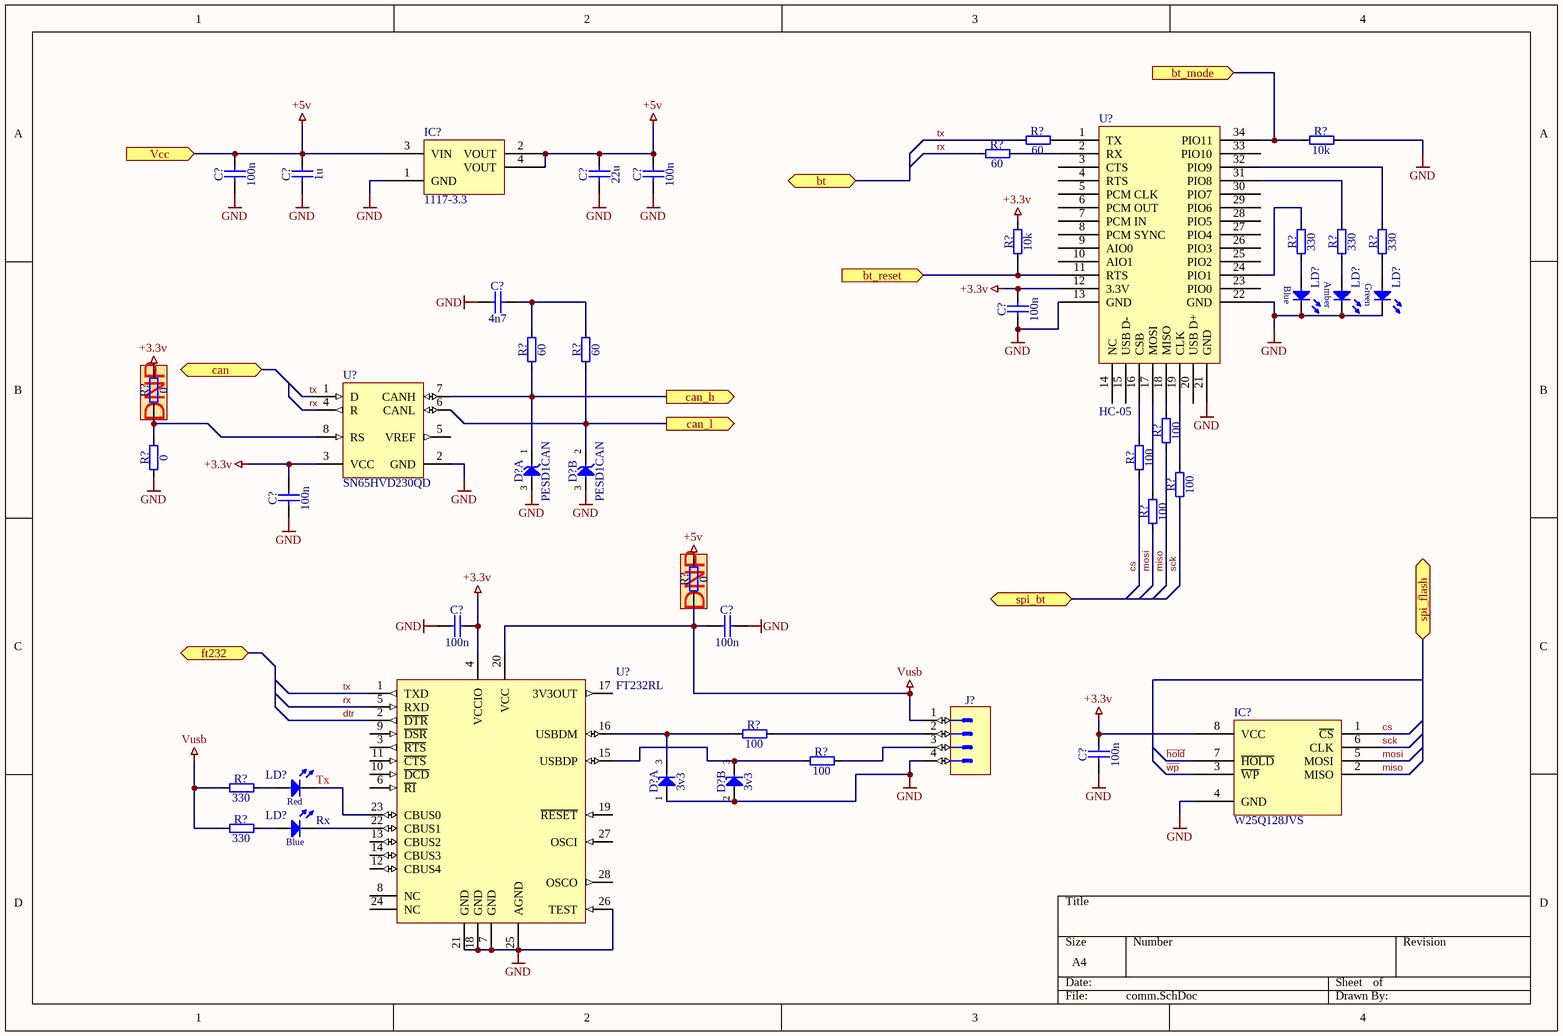
[diagram p4: comm.SchDoc]

### Parts
(Parts that share a designator on the sheet are numbered #1, #2 ... from top to bottom, then left to right.)
C?#54  100n
C?#55  1u
C?#56  22u
C?#57  100n
C?#58  4n7
C?#59  100n
C?#60  100n
C?#61  100n
C?#62  100n
C?#63  100n
D?#6  PESD1CAN  (part A of 2)
D?#7  PESD1CAN  (part B of 2)
D?#8  3v3  (part A of 2)
D?#9  3v3  (part B of 2)
IC?#18  1117-3.3
IC?#19  W25Q128JVS
J?#4  (no value)
LD?#1  (no value)
LD?#2  (no value)
LD?#3  (no value)
LD?#4  (no value)
LD?#5  (no value)
R?#97  60
R?#98  10k
R?#99  60
R?#100  10k
R?#101  330
R?#102  330
R?#103  330
R?#104  60
R?#105  60
R?#106  0
R?#107  100
R?#108  0
R?#109  100
R?#110  100
R?#111  100
R?#112  0
R?#113  100
R?#114  100
R?#115  330
R?#116  330
U?#9  HC-05  [HC-05]
U?#10  SN65HVD230QD  [D8_N]
U?#11  FT232RL  [SSOP-28_N]

### Ports
bt (bidir), bt_mode (in), bt_reset (in), can (bidir), can_h (out), can_l (out), ft232 (bidir), spi_bt (bidir), spi_flash (bidir), Vcc (in)

### Nets
+3.3v: C?#54.2 C?#55.2 C?#56.2 C?#57.2 C?#59.2 C?#60.2 C?#61.2 C?#63.2 IC?#18.2(VOUT) IC?#18.3(VIN) IC?#18.4(VOUT) IC?#19.8(VCC) R?#100.2 R?#106.2 R?#112.2 U?#9.12(3.3V) U?#10.3(VCC) U?#11.4(VCCIO) ; port Vcc  [also labelled +5v]
GND: C?#54.1 C?#55.1 C?#56.1 C?#57.1 C?#58.1 C?#59.1 C?#60.1 C?#61.1 C?#62.1 C?#63.1 D?#6.3(COMA) D?#7.3(COMA) D?#8.1(A) D?#9.2(A) IC?#18.1(GND) IC?#19.4(GND) J?#4.4 LD?#1.1(C) LD?#2.1(C) LD?#3.1(C) R?#98.2 R?#108.1 U?#9.13(GND) U?#9.21(GND) U?#9.22(GND) U?#10.2(GND) U?#11.7(GND) U?#11.18(GND) U?#11.21(GND) U?#11.25(AGND) U?#11.26(TEST)
Vusb: C?#62.2 J?#4.1 R?#112.1 R?#115.1 R?#116.1 U?#11.20(VCC)
can_h: D?#6.1(C) R?#104.1 U?#10.7(CANH) ; port can_h
can_l: D?#7.2(C) R?#105.1 U?#10.6(CANL) ; port can_l
cs: IC?#19.1(~{CS}) R?#109.1
dtr: U?#11.2(~{DTR})
~{hold}: IC?#19.7(~{HOLD})
miso: IC?#19.2(MISO) R?#107.1
mosi: IC?#19.5(MOSI) R?#111.1
rx: R?#99.1 U?#10.4(R) U?#11.5(RXD)
sck: IC?#19.6(CLK) R?#110.1
tx: R?#97.1 U?#10.1(D) U?#11.1(TXD)
~{wp}: IC?#19.3(~{WP})
NetC?#58_2: C?#58.2 R?#104.2 R?#105.2
NetD?#8_3: D?#8.3(COMC) R?#113.1 U?#11.16(USBDM)
NetD?#9_3: D?#9.3(COMC) R?#114.1 U?#11.15(USBDP)
NetJ?#4_2: J?#4.2 R?#113.2
NetJ?#4_3: J?#4.3 R?#114.2
NetLD?#1_2: LD?#1.2(A) R?#101.1
NetLD?#2_2: LD?#2.2(A) R?#102.1
NetLD?#3_2: LD?#3.2(A) R?#103.1
NetLD?#4_1: LD?#4.1(C) U?#11.23(CBUS0)
NetLD?#4_2: LD?#4.2(A) R?#115.2
NetLD?#5_1: LD?#5.1(C) U?#11.22(CBUS1)
NetLD?#5_2: LD?#5.2(A) R?#116.2
NetR?#97_2: R?#97.2 U?#9.1(TX)
NetR?#98_1: R?#98.1 U?#9.34(PIO11) ; port bt_mode
NetR?#99_2: R?#99.2 U?#9.2(RX)
NetR?#100_1: R?#100.1 U?#9.11(RTS) ; port bt_reset
NetR?#101_2: R?#101.2 U?#9.24(PIO1)
NetR?#102_2: R?#102.2 U?#9.31(PIO8)
NetR?#103_2: R?#103.2 U?#9.32(PIO9)
NetR?#106_1: R?#106.1 R?#108.2 U?#10.8(RS)
NetR?#107_2: R?#107.2 U?#9.18(MISO)
NetR?#109_2: R?#109.2 U?#9.16(CSB)
NetR?#110_2: R?#110.2 U?#9.19(CLK)
NetR?#111_2: R?#111.2 U?#9.17(MOSI)

Not connected (* = marked no-connect by the designer): U?#9 3(CTS) 4(RTS) 5(PCM_CLK) 6(PCM_OUT) 7(PCM_IN) 8(PCM_SYNC) 9(AIO0) 10(AIO1) 14(NC) 15(USB_D-) 20(USB_D+) 23(PIO0) 25(PIO2) 26(PIO3) 27(PIO4) 28(PIO5) 29(PIO6) 30(PIO7) 33(PIO10); U?#10 5(VREF); U?#11 3(~{RTS}) 6(~{RI}) 8(NC) 9(~{DSR}) 10(~{DCD}) 11(~{CTS}) 12(CBUS4) 13(CBUS2) 14(CBUS3) 17(3V3OUT) 19(~{RESET}) 24(NC) 27(OSCI) 28(OSCO)

### Notes on the sheet
- (near R?#106) DNP
- (near R?#112) DNP
- (near LD?#4) Tx
- (near LD?#5) Rx
- (in symbol LED Amber 1C 2A) Amber
- (in symbol LED Blue 1C 2A) Blue
- (in symbol LED Green 1C 2A) Green
- (in symbol LED Red 1C 2A) Red

### Library data of the parts
C?#54-C?#63 = Capacitor - non polarized: Non-polarised capacitor
  C?#54 C?#57 C?#59-C?#63: Value: 100n
  C?#55: Value: 1u
  C?#56: Value: 22u
  C?#58: Value: 4n7
D?#6 D?#7 = Diode TVS Uni-Directionnal x2 C1A3_C2A3: Dual Common Anode TVS; Device: PESD1CAN
D?#8 D?#9 = Diode ESD x2 A1C3_A2C3: Dual Common Cathode ESD Protection Diodes; Device: 3v3
IC?#18 = ON Semi NCP1117: 1.0A Low-Dropout Positive Fixed and Adjustable Voltage Regulators
IC?#19 = MICROCHIP FLASH SPI 8PIN: Part Number: W25Q128JVS
J?#4 = Connector 4 Male
LD?#1 LD?#5 = LED Blue 1C 2A
LD?#2 = LED Amber 1C 2A
LD?#3 = LED Green 1C 2A
LD?#4 = LED Red 1C 2A
R?#97-R?#116 = Resistor
  R?#97 R?#99 R?#104 R?#105: Value: 60
  R?#98 R?#100: Value: 10k
  R?#101-R?#103 R?#115 R?#116: Value: 330
  R?#106 R?#112: Value: 0
  R?#107 R?#109-R?#111 R?#113 R?#114: Value: 100
  R?#108: Parameter 1: *; Value: 0
U?#10 = SN65HVD230QD: Automotive Catalog 3.3 V CAN Transceiver, 17 mA, -40 to 125 degC, 8-pin SOIC (D), Green (RoHS & no Sb/Br); Manufacturer: Texas Instruments; Transient Pulse Protection(V): -25 to 25; Supply Voltage(s)(V): 3.3; Drivers Per Package: 1; ICC(Max)(mA): 17; ComponentLink1Description: Datasheet; PartNumber: SN65HVD230QD; Rating: Catalog; Mounting Technology: Surface Mount; DatasheetVersion: SLOS346K; ComponentLink1URL: http://www.ti.com/lit/ds/symlink/sn65hvd230.pdf; Isolated: No; Eco-Plan: Green (RoHS & no Sb/Br); Receivers Per Package: 1; Footprint: PCA82C250; PackageVersion: revM, Jun-2011; SubFamily: CAN; PackageDescription: 8-Pin Plastic Small Outline Integrated Circuit, 4.9 x 3.9 mm, Pitch 1.27 mm Pitch; Code_JEDEC: MS-012AA; PackageReference: D8
U?#11 = FT232RL-Reel: USB UART Asynchronous Serial Data Transfer Chip, SSOP-28, Tape and Reel; Published: 19-Aug-2010; DatasheetVersion: ver 2.07, Jul-2010; PackageVersion: 2010; PackageReference: SSOP-28; Publisher: Altium Limited; PackageDescription: 28-Pin Small Outline Package 0.65 mm Pitch; ComponentLink1Description: Manufacturer Link; ComponentLink1URL: http://www.ftdichip.com/Products/ICs/FT232R.htm; ComponentLink2Description: Datasheet; ComponentLink2URL: http://www.ftdichip.com/Support/Documents/DataSheets/ICs/DS_FT232R.pdf

## Sheet supply.SchDoc
size A4
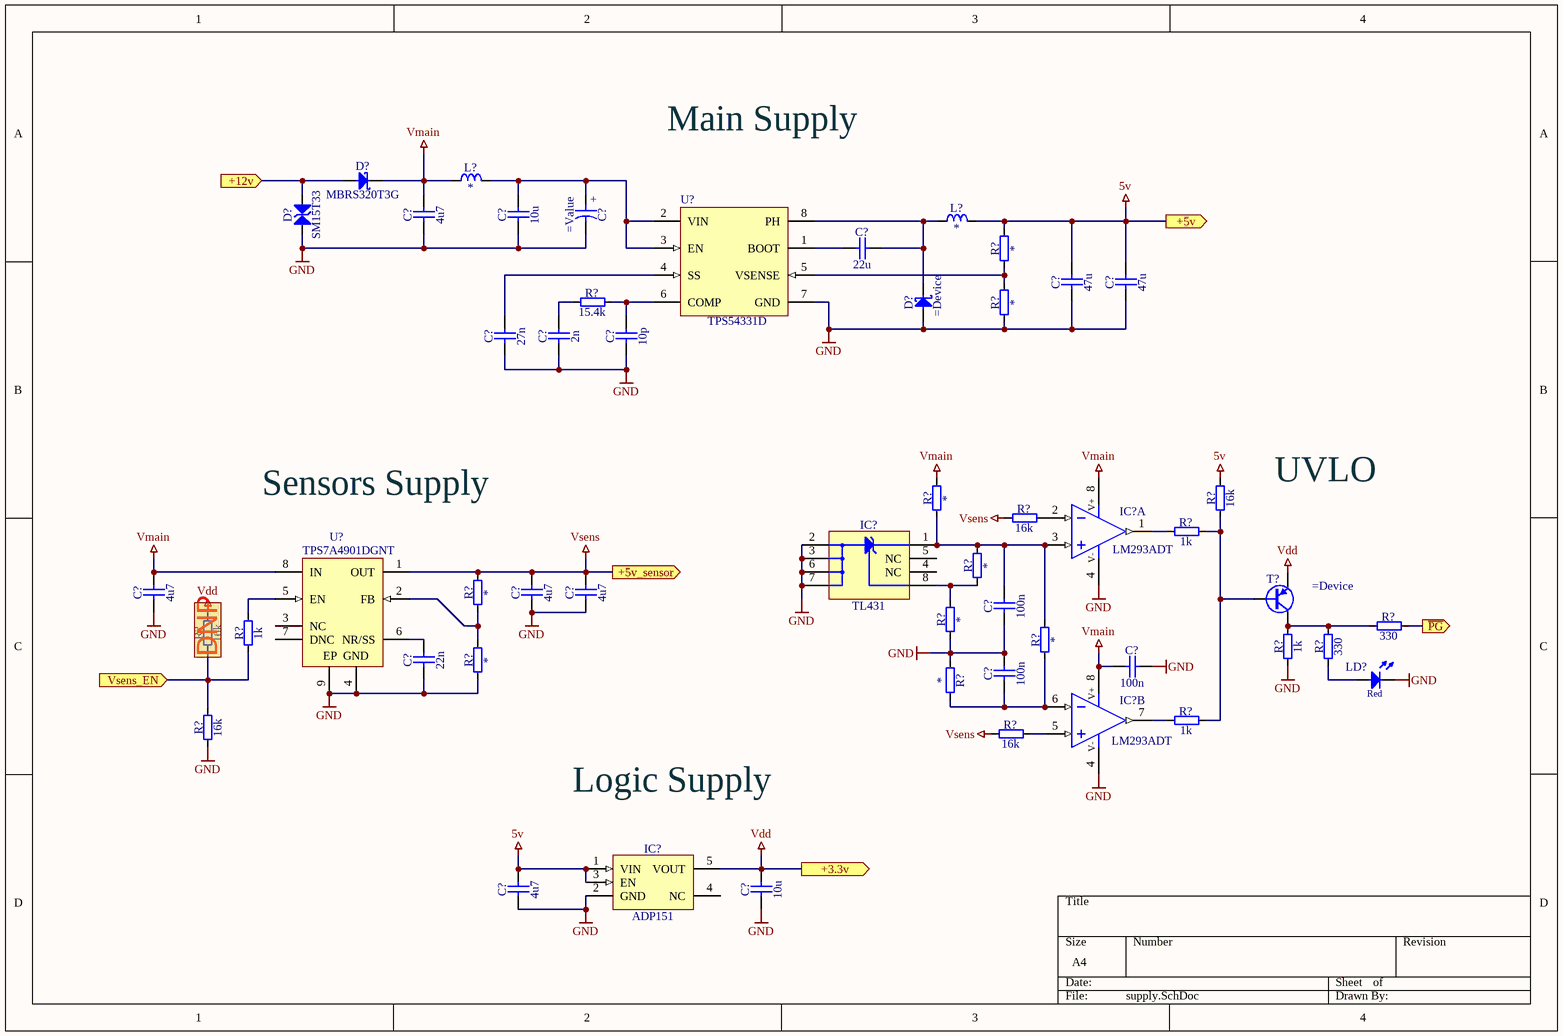
[diagram p5: supply.SchDoc]

### Parts
(Parts that share a designator on the sheet are numbered #1, #2 ... from top to bottom, then left to right.)
C?#64  (no value)
C?#65  4u7
C?#66  10u
C?#67  22u
C?#68  47u
C?#69  47u
C?#70  27n
C?#71  2n
C?#72  10p
C?#73  4u7
C?#74  4u7
C?#75  4u7
C?#76  100n
C?#77  100n
C?#78  22n
C?#79  100n
C?#80  4u7
C?#81  10u
D?#10  MBRS320T3G
D?#11  SM15T33
D?#12  (no value)
IC?#20  LM293ADT  (part A of 2)
IC?#21  TL431
IC?#22  LM293ADT  (part B of 2)
IC?#23  ADP151
L?#2  *
L?#3  *
LD?#6  (no value)
R?#117  *
R?#118  15.4k
R?#119  *
R?#120  *
R?#121  16k
R?#122  16k
R?#123  1k
R?#124  *
R?#125  *
R?#126  330
R?#127  *
R?#128  16k
R?#129  1k
R?#130  *
R?#131  *
R?#132  1k
R?#133  330
R?#134  *
R?#135  1k
R?#136  16k
R?#137  16k
T?  (no value)
U?#12  TPS54331D  [D8_L]
U?#13  TPS7A4901DGNT  [TI-DGN8-1760X1425TP_L]

### Ports
+3.3v (out), +5v (out), +5v_sensor (out), +12v (in), Vsens_EN (in), ~{PG} (out)

### Nets
5v: C?#68.2 C?#69.2 C?#80.2 C?#81.2 IC?#23.1(VIN) IC?#23.3(EN) IC?#23.5(VOUT) L?#3.2 R?#117.2 R?#122.2 R?#128.2 T?.2(E) ; port +5v, port +3.3v  [also labelled Vdd]  [project net +3.3v]
GND: C?#64.2 C?#65.1 C?#66.1 C?#68.1 C?#69.1 C?#70.1 C?#71.1 C?#72.1 C?#73.1 C?#74.1 C?#75.1 C?#76.1 C?#77.2 C?#78.1 C?#79.2 C?#80.1 C?#81.1 D?#11.2(A) D?#12.2(A) IC?#20.4(V-) IC?#21.2(A) IC?#21.3(A) IC?#21.6(A) IC?#21.7(A) IC?#22.4(V-) IC?#23.2(GND) LD?#6.1(C) R?#119.1 R?#127.1 R?#130.1 R?#132.1 R?#134.1 R?#137.1 U?#12.7(GND) U?#13.4(GND) U?#13.9(EP)
Vmain: C?#65.2 C?#73.2 C?#77.1 D?#10.1(C) D?#10.2(A) D?#11.1(C) IC?#20.8(V+) IC?#22.8(V+) L?#2.1 R?#120.2 U?#13.8(IN) ; port +12v
Vsens: C?#74.2 C?#75.2 R?#121.1 R?#125.2 R?#136.1 U?#13.1(OUT) ; port +5v_sensor  [project net +5v_sens]
NetC?#64_1: C?#64.1 C?#66.2 L?#2.2 U?#12.2(VIN) U?#12.3(EN)
NetC?#67_1: C?#67.1 U?#12.1(BOOT)
NetC?#67_2: C?#67.2 D?#12.1(C) L?#3.1 U?#12.8(PH)
NetC?#70_2: C?#70.2 U?#12.4(SS)
NetC?#71_2: C?#71.2 R?#118.1
NetC?#72_2: C?#72.2 R?#118.2 U?#12.6(COMP)
NetC?#76_2: C?#76.2 IC?#20.3(IN+) IC?#21.1(C) R?#120.1 R?#124.2 R?#131.2
NetC?#78_2: C?#78.2 U?#13.6(NR/SS)
NetC?#79_1: C?#79.1 IC?#22.6(IN-) R?#130.2 R?#131.1
NetIC?#20_1: IC?#20.1(OUT) R?#123.1
NetIC?#20_2: IC?#20.2(IN-) R?#121.2
NetIC?#21_8: IC?#21.8(REF) R?#124.1 R?#127.2
NetIC?#22_5: IC?#22.5(IN+) R?#136.2
NetIC?#22_7: IC?#22.7(OUT) R?#135.1
NetLD?#6_2: LD?#6.2(A) R?#133.1
NetR?#117_1: R?#117.1 R?#119.2 U?#12.5(VSENSE)
NetR?#122_1: R?#122.1 R?#123.2 R?#135.2 T?.1(B)
NetR?#125_1: R?#125.1 R?#134.2 U?#13.2(FB)
NetR?#126_1: R?#126.1 R?#132.2 R?#133.2 T?.3(C)
NetR?#126_2: R?#126.2 ; port ~{PG}
NetR?#128_1: R?#128.1 R?#129.1 R?#137.2 ; port Vsens_EN
NetR?#129_2: R?#129.2 U?#13.5(EN)

Not connected (* = marked no-connect by the designer): IC?#21 4(NC) 5(NC); IC?#23 4(NC); U?#13 3(NC) 7(DNC)

### Notes on the sheet
- Main Supply
- Sensors Supply
- UVLO
- (near R?#128) DNP
- Logic Supply
- (in symbol Capacitor - polarized) +
- (in symbol LED Red 1C 2A) Red

### Library data of the parts
C?#64 = Capacitor - polarized: Polarised capacitor
C?#65-C?#81 = Capacitor - non polarized: Non-polarised capacitor
  C?#65 C?#73-C?#75 C?#80: Value: 4u7
  C?#66 C?#81: Value: 10u
  C?#67: Value: 22u
  C?#68 C?#69: Value: 47u
  C?#70: Value: 27n
  C?#71: Value: 2n
  C?#72: Value: 10p
  C?#76 C?#77 C?#79: Value: 100n
  C?#78: Value: 22n
D?#10 D?#12 = Diode Schottky: Schottky Diode
  D?#10: Device: MBRS320T3G
D?#11 = Diode TVS Bi-Directional: Transient Voltage Suppressor Diode (Bi-Directional); Device: SM15T33
IC?#20 IC?#22 = Operational Amplifier x2 Type1: Dual Operational Amplifier; Device: LM293ADT
IC?#21 = TL1431: Precision Programmable Reference; Device: TL431
IC?#23 = ADP151AUJZ: Ultralow Noise, 200 mA CMOS Linear Regulator; Device: ADP151
L?#2 L?#3 = Inductor: Value: *
LD?#6 = LED Red 1C 2A
R?#117-R?#137 = Resistor
  R?#117 R?#119 R?#120 R?#124 R?#125 R?#127 R?#130 R?#131 R?#134: Value: *
  R?#118: Value: 15.4k
  R?#121 R?#122 R?#128 R?#136 R?#137: Value: 16k
  R?#123 R?#129 R?#132 R?#135: Value: 1k
  R?#126 R?#133: Value: 330
T? = PNP B1 E2 C3: PNP Transistor
U?#12 = TPS54331D: Buck Step Down Regulator with 3.5 to 28 V Input and 0.8 to 25 V Output, -40 to 150 degC, 8-Pin SOIC (D), Green (RoHS & no Sb/Br); Manufacturer: Texas Instruments; Vout(Min)(V): 0.8; Vin(Min)(V): 3.5; Duty Cycle(Max)(%): 90; SubFamily: Step-Down Regulator; Iq(Typ)(mA): 0.11; Vin(Max)(V): 28; Rating: Catalog; Vout(Max)(V): 25; Iout(Max)(A): 3; Regulated Outputs(#): 1; PackageReference: D8; Switch Current Limit(Typ)(A): 3.5; Topology: Buck; Eco-Plan: Green (RoHS & no Sb/Br); PartNumber: TPS54331D; ComponentLink1Description: Datasheet; ComponentLink2Description: Package Specification; DatasheetVersion: SLVS839D; ComponentLink3URL: Samples URL:http://www.ti.com/product/tps54331#samples; ComponentLink1URL: http://www.ti.com/general/docs/lit/getliterature.tsp?genericPartNumber=TPS54331&fileType=pdf; Code_JEDEC: MS-012AA; ComponentLink2URL: http://www.ti.com/litv/pdf/msoi002j; ComponentLink3Description: URL Link1; PackageVersion: revM, Jun-2011; Mounting Technology: Surface Mount; PackageDescription: 8-Pin Plastic Small Outline Integrated Circuit, 4.9 x 3.9 mm, Pitch 1.27 mm Pitch
U?#13 = TPS7A4901DGNT: Single Output High PSRR LDO, 150 mA, Adjustable 1.2 to 33 V Output, 3 to 36 V Input, with Ultra-Low Noise, 8-pin MSOP (DGN), -40 to 125 degC, Green (RoHS & no Sb/Br); Manufacturer: Texas Instruments; Accuracy(%): 1.5; Iq(Typ)(mA): 0.06; Vin(Min)(V): 3; Vout Adj(Min)(V): 1.2; SubFamily: Single Channel LDO; Vout Adj(Max)(V): 33; Vin(Max)(V): 36; Power Good: TRUE; Iout(Max)(A): 0.15; Vdo(Typ)(mV): 260; Eco-Plan: Green (RoHS & no Sb/Br); PartNumber: TPS7A4901DGNT; ComponentLink1Description: Manufacturer URL; ComponentLink2Description: Datasheet; DatasheetVersion: SBVS121B; ComponentLink3URL: http://www.ti.com/litv/pdf/mpds046e; ComponentLink1URL: http://www.ti.com/; Code_JEDEC: MO-187; ComponentLink2URL: http://www.ti.com/general/docs/lit/getliterature.tsp?genericPartNumber=TPS7A4901&fileType=pdf; ComponentLink3Description: Package Specification; PackageVersion: 4073271/F; Mounting Technology: Surface Mount; PackageReference: DGN8-1760X1425TP; PackageDescription: 8-pin Plastic Small Outline, Body 3 x 3 mm, Pitch 0.65 mm

## Sheet mcu.SchDoc
size A4
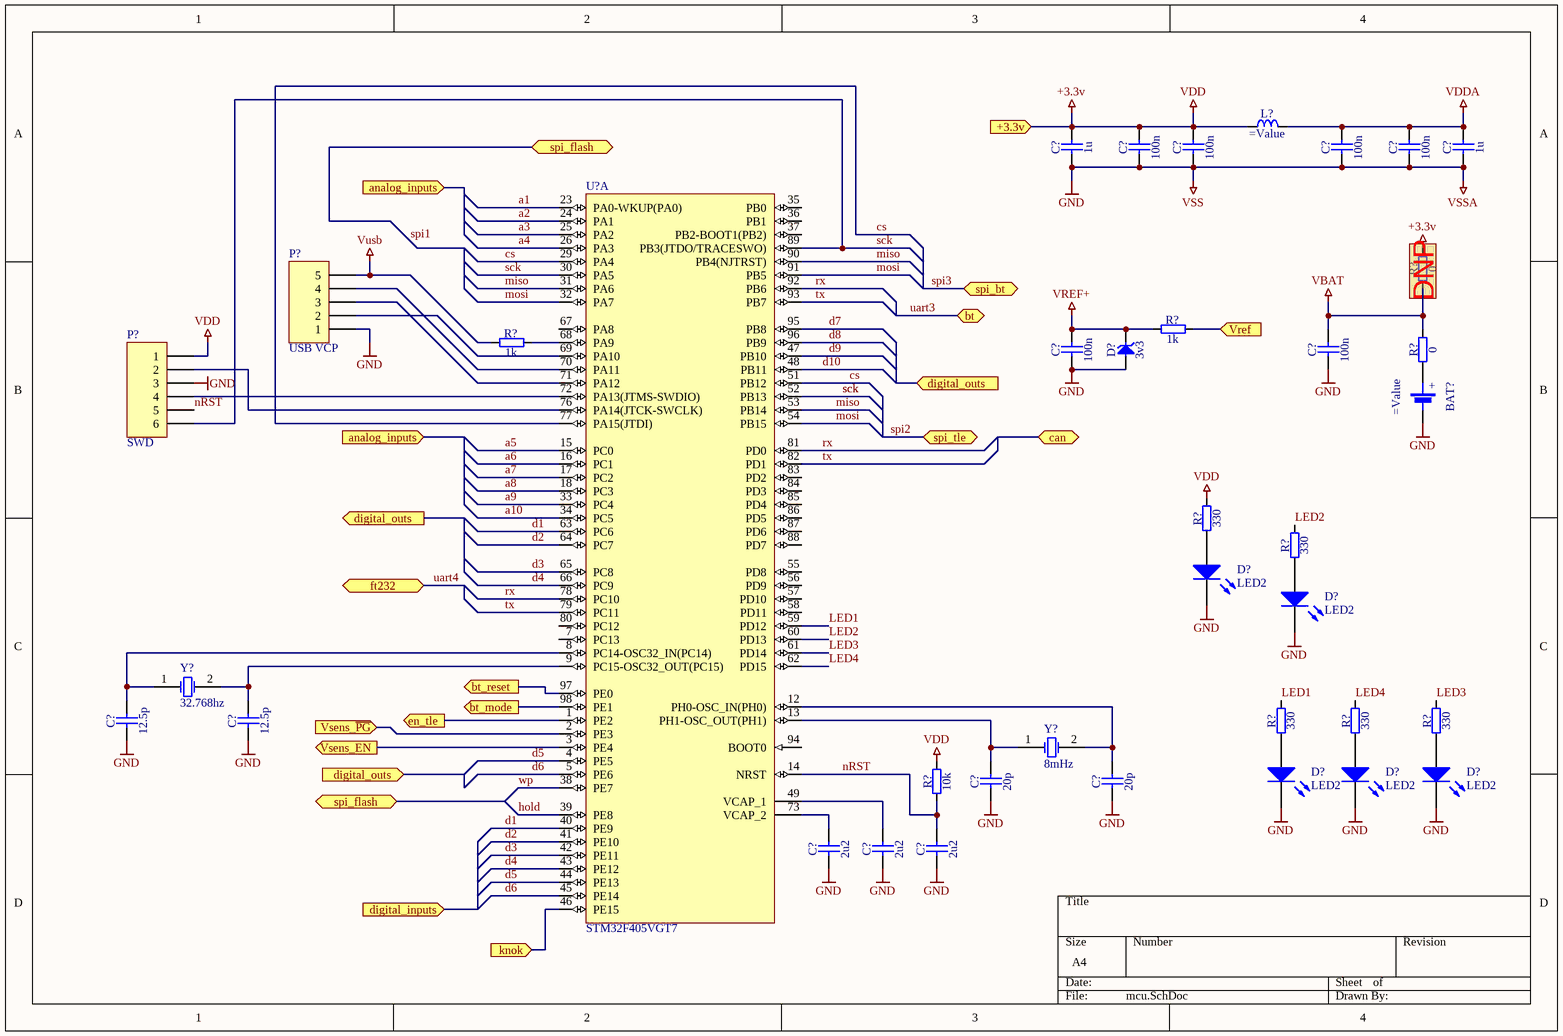
[diagram p6: mcu.SchDoc]

### Parts
(Parts that share a designator on the sheet are numbered #1, #2 ... from top to bottom, then left to right.)
BAT?  (no value)
C?#82  1u
C?#83  100n
C?#84  100n
C?#85  100n
C?#86  100n
C?#87  1u
C?#88  100n
C?#89  100n
C?#90  12.5p
C?#91  12.5p
C?#92  20p
C?#93  20p
C?#94  2u2
C?#95  2u2
C?#96  2u2
D?#13  3v3
D?#14  LED2  [3.2X1.6X1.1]
D?#15  LED2  [3.2X1.6X1.1]
D?#16  LED2  [3.2X1.6X1.1]
D?#17  LED2  [3.2X1.6X1.1]
D?#18  LED2  [3.2X1.6X1.1]
L?#4  (no value)
P?#1  SWD  [HDR1X6]
P?#2  USB VCP  [HDR1X5]
R?#138  0
R?#139  1k
R?#140  1k
R?#141  0
R?#142  330
R?#143  330
R?#144  330
R?#145  330
R?#146  330
R?#147  10k
U?#14  STM32F405VGT7  [STM-LQFP100_L]  (part A of 2)
Y?#1  32.768hz  [R38]
Y?#2  8mHz  [R38]

### Ports
+3.3v (in), analog_inputs (in), bt (bidir), bt_mode (out), bt_reset (out), can (bidir), digital_inputs (in), digital_outs (in), digital_outs (out), en_tle (out), ft232 (bidir), knok (in), spi_bt (bidir), spi_flash (bidir), spi_tle (bidir), Vref (in), Vsens_EN (out), Vsens_~{PG} (in)

### Nets
+3.3v: C?#82.2 C?#83.2 C?#84.2 L?#4.1 P?#1.1 R?#138.2 R?#142.2 R?#147.2 ; port +3.3v  [also labelled VDD]
GND: BAT?.2(MINUS) C?#82.1 C?#83.1 C?#84.1 C?#85.1 C?#86.1 C?#87.1 C?#88.1 C?#89.1 C?#90.1 C?#91.1 C?#92.1 C?#93.1 C?#94.1 C?#95.1 C?#96.1 D?#13.2(A) D?#14.2(K) D?#15.2(K) D?#16.2(K) D?#17.2(K) D?#18.2(K) P?#1.3 P?#2.1  [also labelled VSS, VSSA]
VBAT: C?#89.2 R?#138.1 R?#141.2
VDDA: C?#85.2 C?#86.2 C?#87.2 L?#4.2
VREF+: C?#88.2 D?#13.1(C) R?#139.1
Vusb: P?#2.5 R?#140.1
a1: U?#14.23(PA0-WKUP(PA0))
a2: U?#14.24(PA1)
a3: U?#14.25(PA2)
a4: U?#14.26(PA3)
a5: U?#14.15(PC0)
a6: U?#14.16(PC1)
a7: U?#14.17(PC2)
a8: U?#14.18(PC3)
a9: U?#14.33(PC4)
a10: U?#14.34(PC5)
cs: U?#14.29(PA4) U?#14.51(PB12) U?#14.77(PA15(JTDI))
d1: U?#14.40(PE9) U?#14.63(PC6)
d2: U?#14.41(PE10) U?#14.64(PC7)
d3: U?#14.42(PE11) U?#14.65(PC8)
d4: U?#14.43(PE12) U?#14.66(PC9)
d5: U?#14.4(PE5) U?#14.44(PE13)
d6: U?#14.5(PE6) U?#14.45(PE14)
d7: U?#14.95(PB8)
d8: U?#14.96(PB9)
d9: U?#14.47(PB10)
d10: U?#14.48(PB11)
hold: U?#14.39(PE8)
LED1: R?#144.2 U?#14.59(PD12)
LED2: R?#143.2 U?#14.60(PD13)
LED3: R?#146.2 U?#14.61(PD14)
LED4: R?#145.2 U?#14.62(PD15)
miso: U?#14.31(PA6) U?#14.53(PB14) U?#14.90(PB4(NJTRST))
mosi: U?#14.32(PA7) U?#14.54(PB15) U?#14.91(PB5)
nRST: C?#96.2 P?#1.5 R?#147.1 U?#14.14(NRST)
rx: U?#14.78(PC10) U?#14.81(PD0) U?#14.92(PB6)
sck: P?#1.6 U?#14.30(PA5) U?#14.52(PB13) U?#14.89(PB3(JTDO/TRACESWO))
tx: U?#14.79(PC11) U?#14.82(PD1) U?#14.93(PB7)
wp: U?#14.38(PE7)
NetBAT?_1: BAT?.1(PLUS) R?#141.1
NetC?#90_2: C?#90.2 U?#14.8(PC14-OSC32_IN(PC14)) Y?#1.1(OSC1)
NetC?#91_2: C?#91.2 U?#14.9(PC15-OSC32_OUT(PC15)) Y?#1.2(OSC2)
NetC?#92_2: C?#92.2 U?#14.13(PH1-OSC_OUT(PH1)) Y?#2.1(OSC1)
NetC?#93_2: C?#93.2 U?#14.12(PH0-OSC_IN(PH0)) Y?#2.2(OSC2)
NetC?#94_2: C?#94.2 U?#14.73(VCAP_2)
NetC?#95_2: C?#95.2 U?#14.49(VCAP_1)
NetD?#14_1: D?#14.1(A) R?#142.1
NetD?#15_1: D?#15.1(A) R?#143.1
NetD?#16_1: D?#16.1(A) R?#144.1
NetD?#17_1: D?#17.1(A) R?#145.1
NetD?#18_1: D?#18.1(A) R?#146.1
NetIC?#12_4: U?#14.46(PE15) ; port knok
NetP?#1_2: P?#1.2 U?#14.76(PA14(JTCK-SWCLK))
NetP?#1_4: P?#1.4 U?#14.72(PA13(JTMS-SWDIO))
NetP?#2_2: P?#2.2 U?#14.69(PA10)
NetP?#2_3: P?#2.3 U?#14.71(PA12)
NetP?#2_4: P?#2.4 U?#14.70(PA11)
NetR?#1_2: R?#139.2 ; port Vref
NetR?#96_2: U?#14.1(PE2) ; port en_tle
NetR?#98_1: U?#14.98(PE1) ; port bt_mode
NetR?#100_1: U?#14.97(PE0) ; port bt_reset
NetR?#126_2: U?#14.2(PE3) ; port Vsens_~{PG}
NetR?#128_1: U?#14.3(PE4) ; port Vsens_EN
NetR?#140_2: R?#140.2 U?#14.68(PA9)

Not connected (* = marked no-connect by the designer): U?#14 7(PC13) 35(PB0) 36(PB1) 37(PB2-BOOT1(PB2)) 55(PD8) 56(PD9) 57(PD10) 58(PD11) 67(PA8) 80(PC12) 83(PD2) 84(PD3) 85(PD4) 86(PD5) 87(PD6) 88(PD7) 94(BOOT0)

### Buses and harness runs
bus spi1 = port spi_flash
bus spi2 = port spi_tle
bus spi3 = port spi_bt
bus uart3 = port bt
bus uart4 = port ft232

### Notes on the sheet
- (near R?#138) DNP
- (in symbol Battery 2 Pin) +

### Library data of the parts
BAT? = Battery 2 Pin
C?#82-C?#96 = Capacitor - non polarized: Non-polarised capacitor
  C?#82 C?#87: Value: 1u
  C?#83-C?#86 C?#88 C?#89: Value: 100n
  C?#90 C?#91: Value: 12.5p
  C?#92 C?#93: Value: 20p
  C?#94-C?#96: Value: 2u2
D?#13 = Diode TVS Uni-Directional: Transient Voltage Suppressor Diode (Uni-Directional); Device: 3v3
D?#14-D?#18 = LED2: Typical RED, GREEN, YELLOW, AMBER GaAs LED; Published: 8-Jun-2000; LatestRevisionDate: 17-Jul-2002; LatestRevisionNote: Re-released for DXP Platform.; PackageVersion: Feb-2002; PackageReference: 3.2X1.6X1.1; Publisher: Altium Limited; PackageDescription: SM LED; 2 Flat Leads
L?#4 = Inductor
P?#1 = Header 6: Header, 6-Pin; LatestRevisionDate: 17-Jul-2002; LatestRevisionNote: Re-released for DXP Platform.; Publisher: Altium Limited
P?#2 = Header 5: Header, 5-Pin; LatestRevisionDate: 17-Jul-2002; LatestRevisionNote: Re-released for DXP Platform.; Publisher: Altium Limited
R?#138-R?#147 = Resistor
  R?#138 R?#141: Value: 0
  R?#139 R?#140: Value: 1k
  R?#142-R?#146: Value: 330
  R?#147: Value: 10k
U?#14 = STM32F405VGT7: ARM Cortex-M4 32-bit MCU+FPU, 210 DMIPS, 1024 kB Flash, 192 kB Internal RAM, 82 I/Os, 100-pin LQFP, -40 to 105 degC, Tray; Manufacturer: STMicroelectronics; Operating Frequency(F) (Processor speed) (MHz): 168; Internal RAM Size (kB): 192; Supply Voltage(Vcc) max (V): 3.6; I/Os (High Current): 82; Supply Voltage(Vcc) min (V): 1.8; FLASH Size (Prog) (kB): 1024; D/A Converter: 2x12-bit; ComponentLink1Description: Manufacturer URL; PartNumber: STM32F405VGT7; Core: ARM Cortex-M4; ComponentLink2Description: Datasheet; DatasheetVersion: Rev. 4; ComponentLink3URL: http://www.st.com/st-web-ui/static/active/en/resource/technical/document/data_brief/DM00071938.pdf; ComponentLink1URL: http://www.st.com/web/en/home.html; Packing: Tray; ComponentLink2URL: http://www.st.com/st-web-ui/static/active/en/resource/technical/document/datasheet/DM00037051.pdf; PackageReference: LQFP100; ComponentLink3Description: Package Specification; PackageVersion: Rev. 1, 06/2013; Mounting Technology: Surface Mount; PackageDescription: 100-Pin Low Profile Quad Flat Package, 14 x 14 mm Body, 0.5 mm Pitch
Y?#1 Y?#2 = XTAL: Crystal Oscillator; Published: 8-Jun-2000; LatestRevisionDate: 17-Jul-2002; LatestRevisionNote: Re-released for DXP Platform.; PackageReference: R38; Publisher: Altium Limited; PackageDescription: Crystal, Thru-Hole; 2 Leads; Body 3.1 x 8.2 mm (Dia.xH)
  Y?#1: Value: 32.768hz
  Y?#2: Value: 8mHz

## Nets that join several sheets
+3.3v: analog (6 pins), digital (23 pins), outputs (5 pins), comm (18 pins), supply (12 pins), mcu (8 pins)
+5v_sens: main (J?#3.27), analog (9 pins), digital (5 pins), supply (6 pins)
AGND: main (J?#3.28), analog (R?#8.1)
GND: main (J?#3.29 J?#3.30), analog (40 pins), digital (39 pins), outputs (39 pins), comm (31 pins), supply (36 pins), mcu (24 pins)
Vmain: main (J?#2.18), analog (R?#35.2), outputs (5 pins), supply (11 pins)
Vusb: comm (6 pins), mcu (P?#2.5 R?#140.1)
at1: main (J?#1.1), analog (R?#4.1 R?#5.1 R?#7.2)
at2: main (J?#2.13), analog (R?#10.1 R?#11.1 R?#13.2)
av1: main (J?#3.24), analog (R?#15.1 R?#16.1 R?#18.2)
av2: main (J?#1.2), analog (R?#20.1 R?#21.1 R?#24.2)
av4: main (J?#3.25), analog (R?#32.1 R?#33.1 R?#36.2)
av5: main (J?#1.3), analog (R?#38.1 R?#39.1 R?#42.2)
av6: main (J?#2.15), analog (R?#44.1 R?#45.1 R?#47.2)
can_h: main (J?#2.20), comm (D?#6.1 R?#104.1 U?#10.7)
can_l: main (J?#1.9), comm (D?#7.2 R?#105.1 U?#10.6)
d1: digital (IC?#6.6), outputs (IC?#14.1 R?#84.2)
d2: digital (IC?#7.4), outputs (IC?#15.3 R?#87.2)
d3: digital (IC?#8.6), outputs (IC?#16.1 R?#92.2)
d4: digital (IC?#9.4), outputs (IC?#17.3 R?#95.2)
d5: digital (IC?#10.6), outputs (R?#82.1 R?#85.2)
d6: digital (R?#53.1 U?#1.7), outputs (R?#83.1 R?#86.2)
do1: main (J?#1.10), outputs (C?#41.1 RT?#1.2)
do2: main (J?#2.21), outputs (C?#42.2 RT?#2.2)
do3: main (J?#3.33), outputs (C?#46.1 RT?#3.2)
do4: main (J?#3.32), outputs (C?#47.2 RT?#4.2)
hall1: main (J?#1.5), digital (C?#17.2 R?#48.1 R?#49.1 R?#50.2)
hall2: main (J?#2.17), digital (C?#20.2 R?#54.1 R?#55.1 R?#59.2)
knok: main (J?#3.26), digital (C?#35.1)
lo1: main (J?#1.12), outputs (C?#43.2 U?#3.4)
lo2: main (J?#2.23), outputs (C?#45.2 U?#4.4)
lo3: main (J?#1.11), outputs (C?#48.2 U?#6.4)
lo4: main (J?#2.22), outputs (C?#50.2 U?#7.4)
NetIC?#12_4: digital (IC?#12.4), mcu (U?#14.46)
NetR?#1_2: analog (R?#1.2 R?#2.2), mcu (R?#139.2)
NetR?#96_2: outputs (R?#96.2 U?#8.13), mcu (U?#14.1)
NetR?#98_1: comm (R?#98.1 U?#9.34), mcu (U?#14.98)
NetR?#100_1: comm (R?#100.1 U?#9.11), mcu (U?#14.97)
NetR?#126_2: supply (R?#126.2), mcu (U?#14.2)
NetR?#128_1: supply (R?#128.1 R?#129.1 R?#137.2), mcu (U?#14.3)
phl1: main (J?#3.34), outputs (C?#49.1 U?#8.6 U?#8.7)
phl2: main (J?#3.35), outputs (C?#51.2 U?#8.14 U?#8.15)
sw1: main (J?#1.8), digital (C?#23.2 R?#64.1 R?#65.1 R?#68.2)
sw2: main (J?#2.19), digital (C?#26.2 R?#69.1 R?#70.1 R?#71.2)
sw3: main (J?#3.31), digital (C?#28.2 R?#72.1 R?#73.1 R?#74.2)
vr+: main (J?#1.4), digital (R?#51.1)
vr-: main (J?#2.16), digital (R?#56.1)